# EasyEDA schematic co49kb-key-rgb-lp.json
TITLE: Sheet_1; REV: 1.0; Date: 2019-12-10; Sheet: 1/1; Drawn By: lainema; Company: Your Company
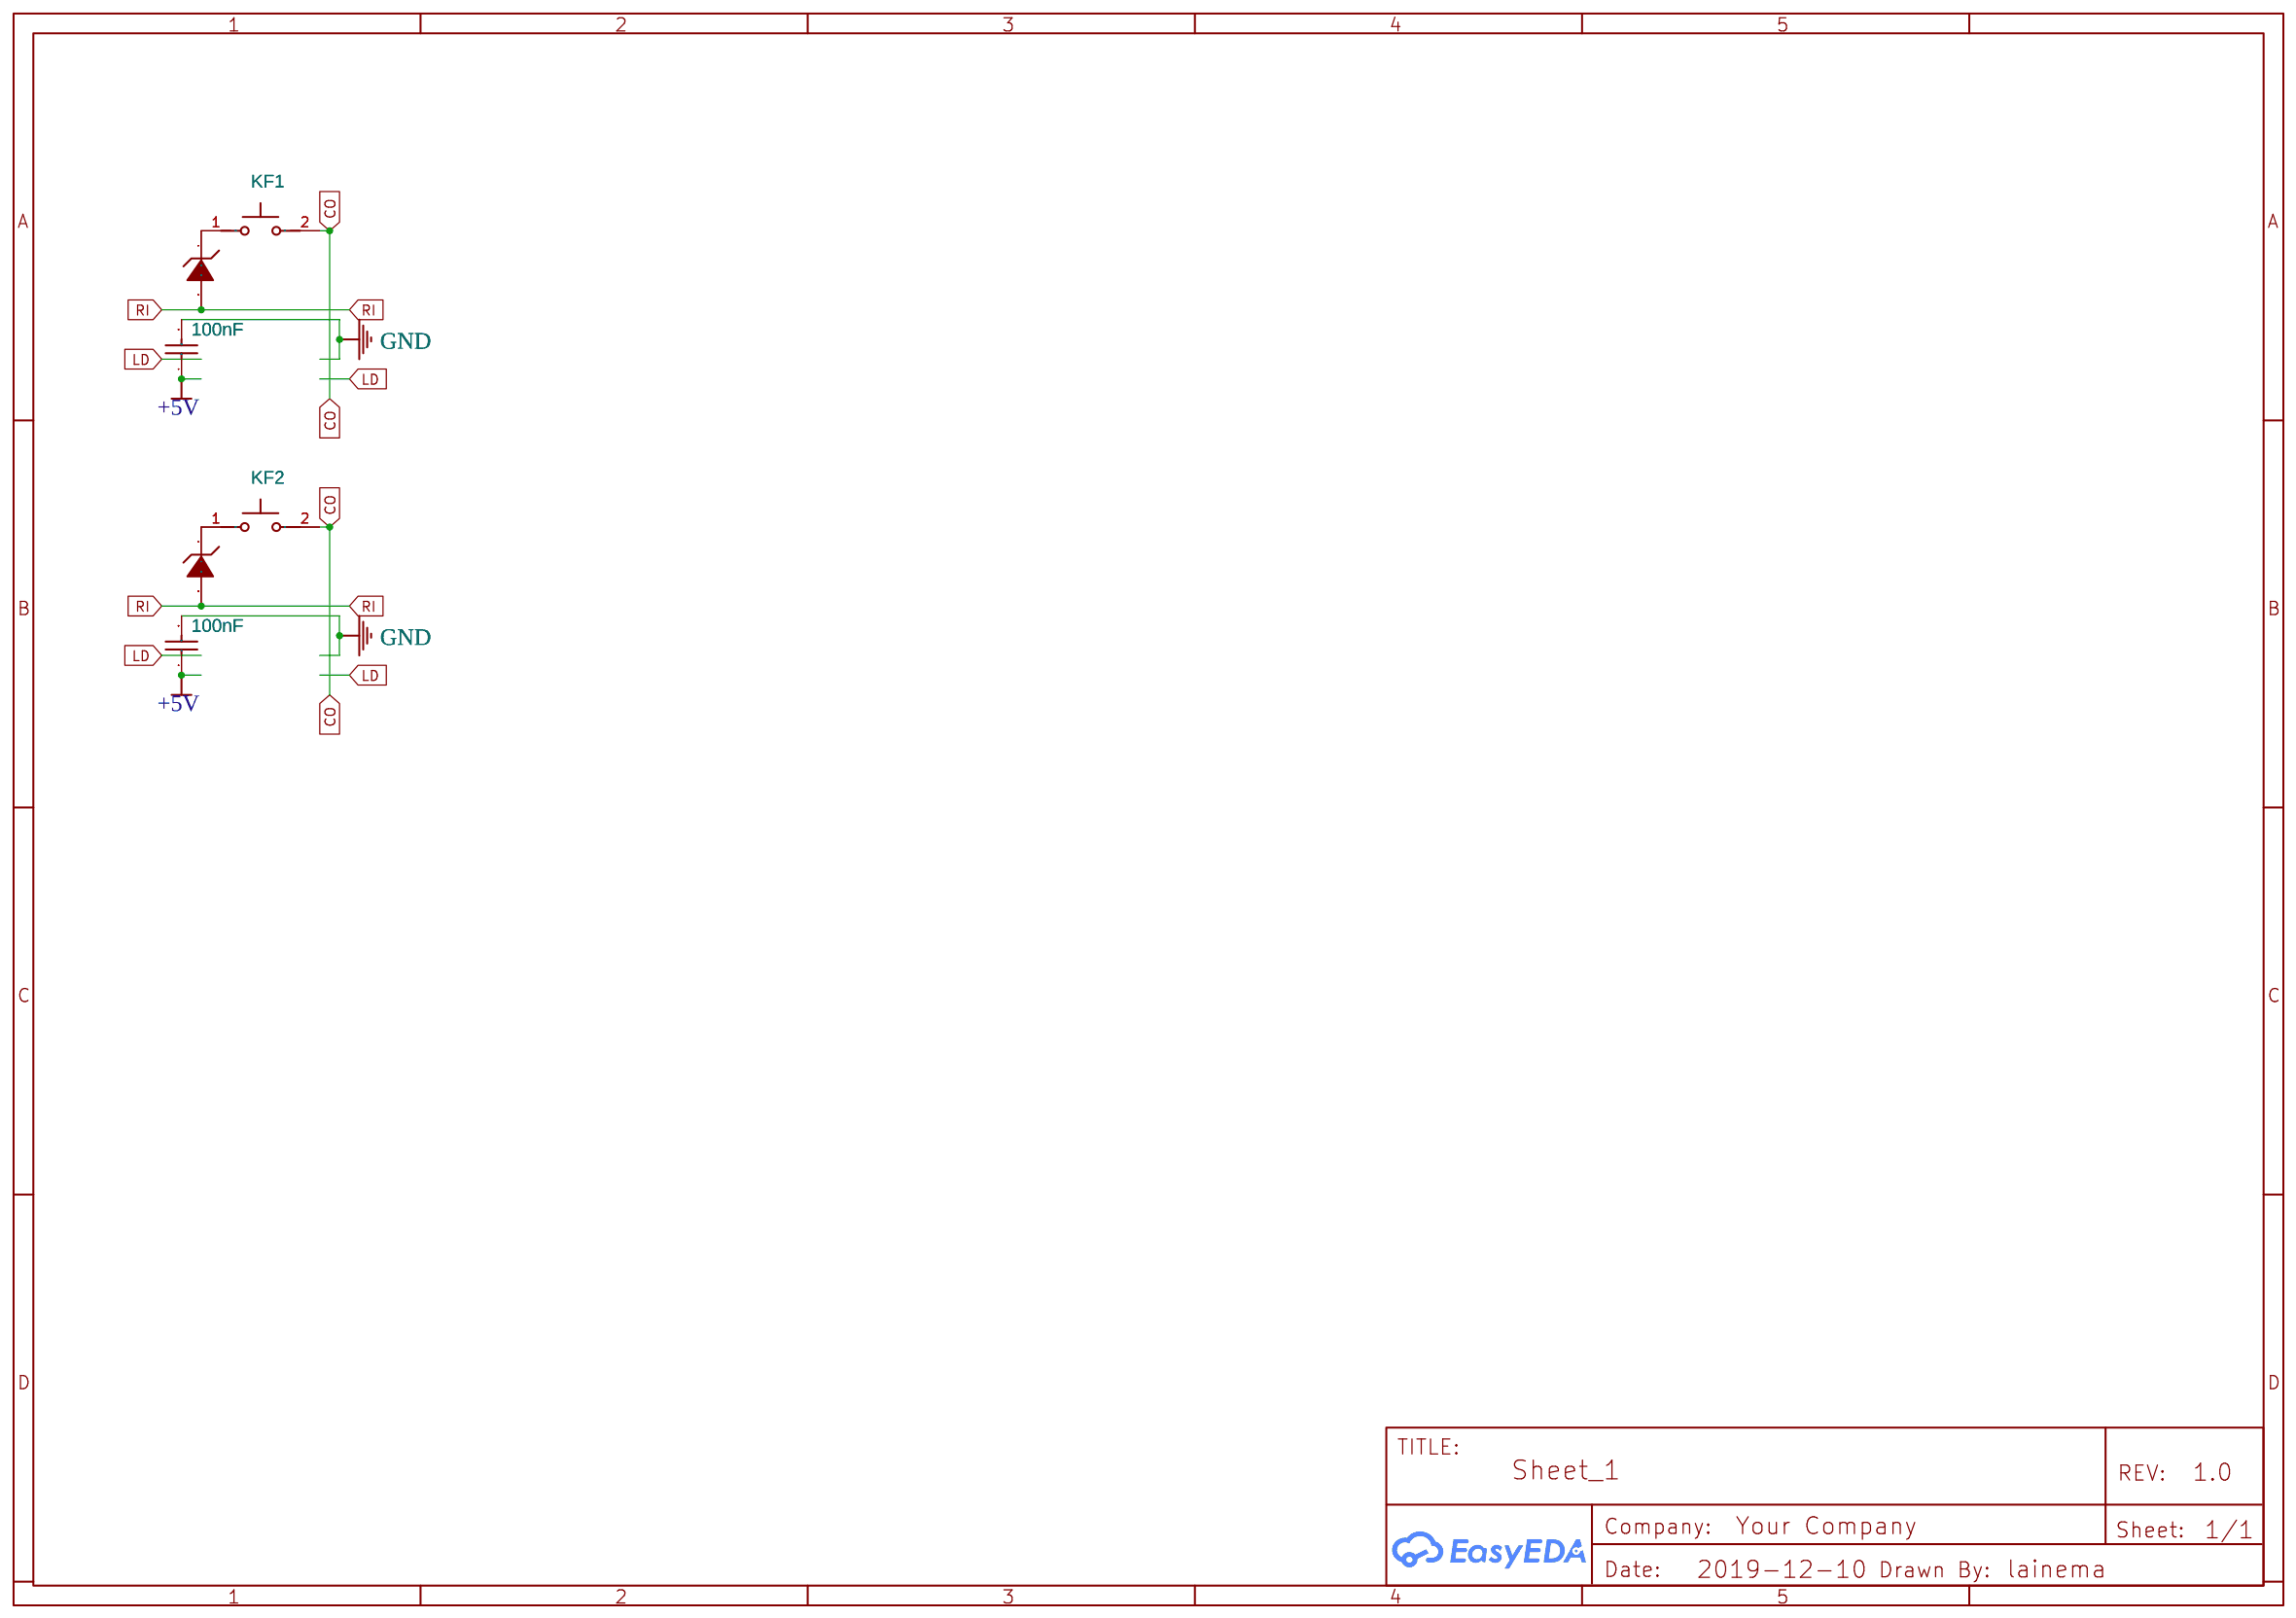
[diagram p0: schematic sheet]

## Parts
C1  100nF  [0402]
C2  100nF  [0402]
D1  BZT52C3V3  [SOD-123_L2.7-W1.6-LS3.7-RD]
D2  BZT52C3V3  [SOD-123_L2.7-W1.6-LS3.7-RD]
KF1  CPG135001D02  [KEY-TH_CPG135001D0X]
KF2  CPG135001D02  [KEY-TH_CPG135001D0X]

## Library data of the parts
C1 C2 = CL05B104KO5NNNC: Supplier: LCSC; Manufacturer: SAMSUNG; LCSC Assembly: Yes; Supplier Part: C1525; SMT Type: Basic
D1 D2 = -: Supplier Part: C173413; Supplier: LCSC; Manufacturer: MDD; Contributor: LCSC; LCSC Assembly: Yes; SMT Type: Extend
KF1 KF2 = -: Supplier: LCSC; Supplier Part: C400230; Manufacturer: Kailh; Contributor: LCSC

## Nets
+5V: C1.1 C2.1
GND: C1.2 C2.2
CO: KF1.2(RKO) KF2.2(RKO)
RI: D1.2(A) D2.2(A)
Net-(D1-1): D1.1(K) KF1.1(CKI)
Net-(D2-1): D2.1(K) KF2.1(CKI)
